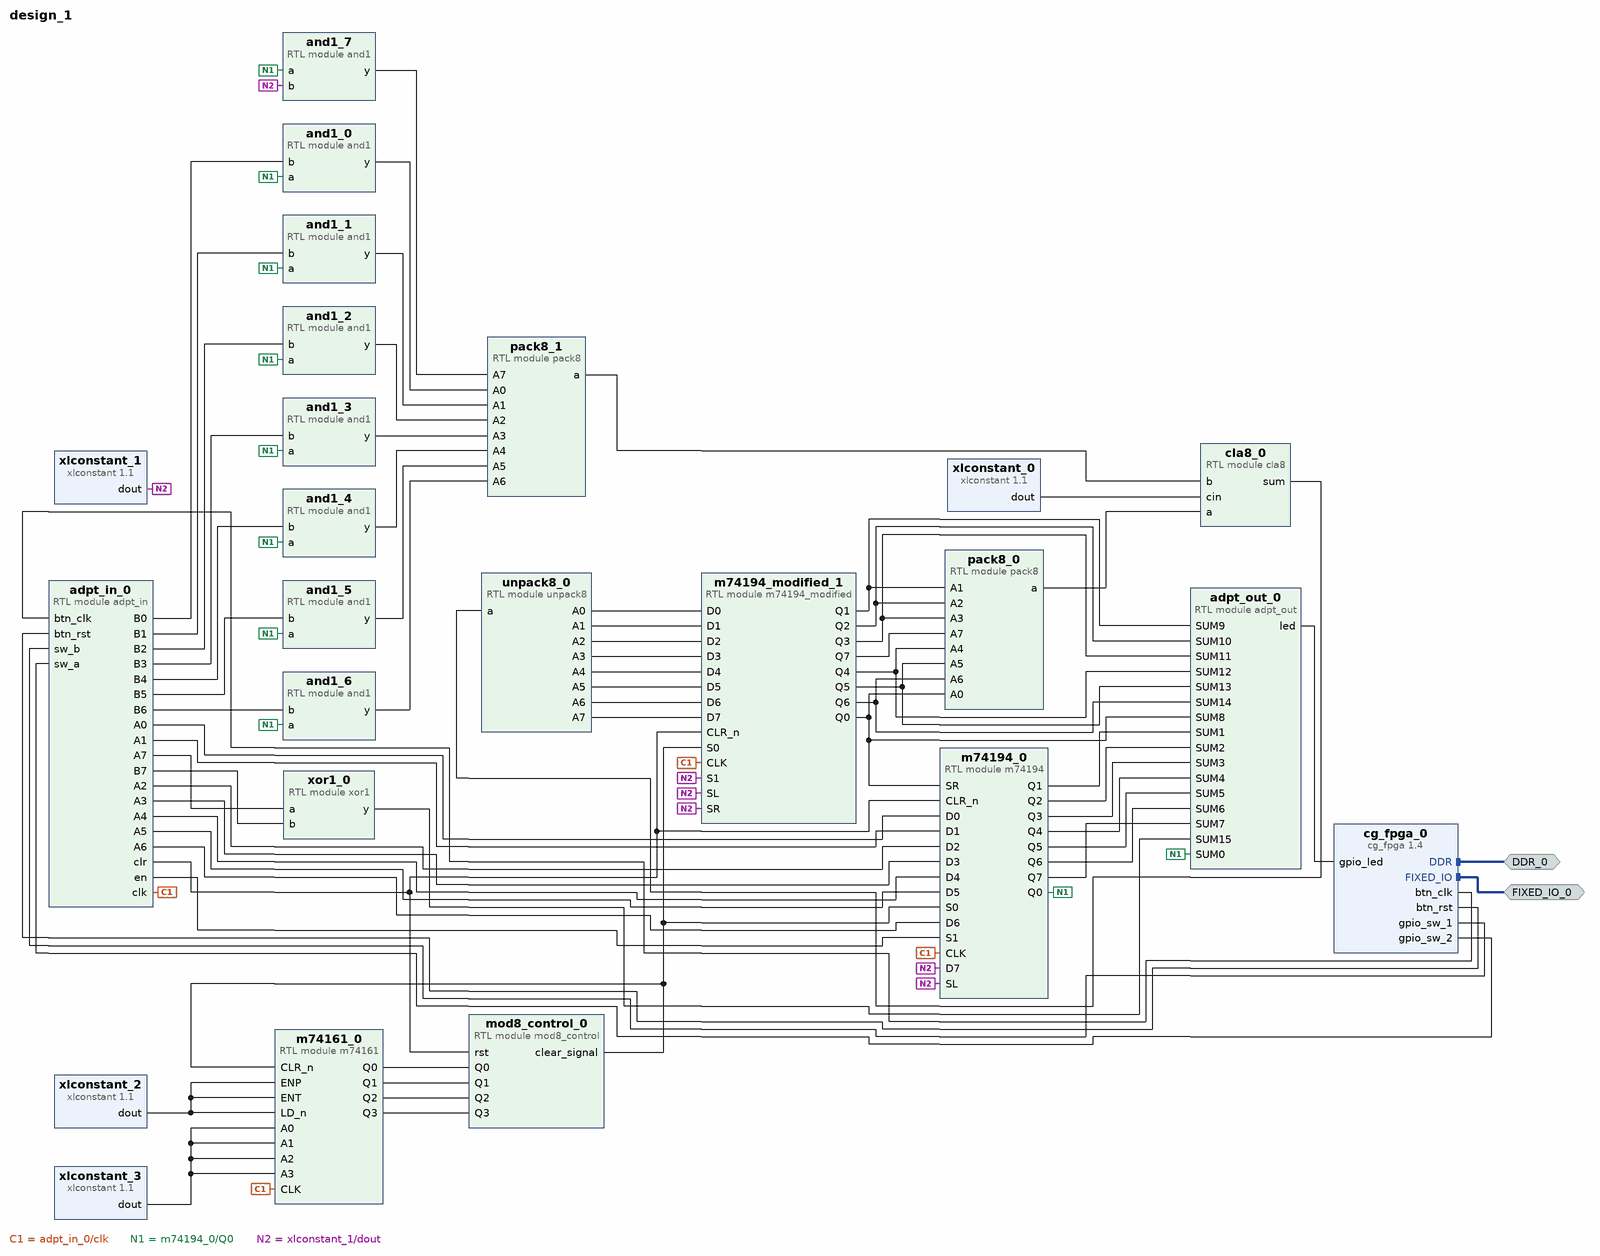
[diagram p0: block diagram of the top level]
# Vivado block design design_1, xc7z020clg400-1, Vivado 2024.2
create_bd_design design_1

create_bd_intf_port -mode Master -vlnv xilinx.com:display_processing_system7:fixedio_rtl:1.0 FIXED_IO_0
create_bd_intf_port -mode Master -vlnv xilinx.com:interface:ddrx_rtl:1.0 DDR_0

create_bd_cell -type ip -vlnv educg.net:user:cg_fpga:1.4 cg_fpga_0
create_bd_cell -type module -reference adpt_in adpt_in_0
create_bd_cell -type module -reference adpt_out adpt_out_0
create_bd_cell -type module -reference cla8 cla8_0
create_bd_cell -type ip -vlnv xilinx.com:ip:xlconstant:1.1 xlconstant_0
set_property -dict {CONFIG.CONST_VAL 0} [get_bd_cells xlconstant_0]
create_bd_cell -type module -reference pack8 pack8_0
create_bd_cell -type module -reference mod8_control mod8_control_0
create_bd_cell -type module -reference pack8 pack8_1
create_bd_cell -type module -reference unpack8 unpack8_0
create_bd_cell -type module -reference and1 and1_0
create_bd_cell -type module -reference and1 and1_1
create_bd_cell -type module -reference and1 and1_2
create_bd_cell -type module -reference and1 and1_3
create_bd_cell -type module -reference and1 and1_4
create_bd_cell -type module -reference and1 and1_5
create_bd_cell -type module -reference and1 and1_6
create_bd_cell -type module -reference and1 and1_7
create_bd_cell -type ip -vlnv xilinx.com:ip:xlconstant:1.1 xlconstant_1
set_property -dict {CONFIG.CONST_VAL 0} [get_bd_cells xlconstant_1]
create_bd_cell -type module -reference m74161 m74161_0
create_bd_cell -type ip -vlnv xilinx.com:ip:xlconstant:1.1 xlconstant_2
create_bd_cell -type ip -vlnv xilinx.com:ip:xlconstant:1.1 xlconstant_3
set_property -dict {CONFIG.CONST_VAL 0} [get_bd_cells xlconstant_3]
create_bd_cell -type module -reference m74194 m74194_0
create_bd_cell -type module -reference xor1 xor1_0
create_bd_cell -type module -reference m74194_modified m74194_modified_1

# ---- connections ----

connect_bd_intf_net [get_bd_intf_ports DDR_0] [get_bd_intf_pins cg_fpga_0/DDR]
connect_bd_intf_net [get_bd_intf_ports FIXED_IO_0] [get_bd_intf_pins cg_fpga_0/FIXED_IO]
connect_bd_net [get_bd_pins adpt_in_0/A0] [get_bd_pins m74194_0/D0]
connect_bd_net [get_bd_pins adpt_in_0/A1] [get_bd_pins m74194_0/D1]
connect_bd_net [get_bd_pins adpt_in_0/A2] [get_bd_pins m74194_0/D2]
connect_bd_net [get_bd_pins adpt_in_0/A3] [get_bd_pins m74194_0/D3]
connect_bd_net [get_bd_pins adpt_in_0/A4] [get_bd_pins m74194_0/D4]
connect_bd_net [get_bd_pins adpt_in_0/A5] [get_bd_pins m74194_0/D5]
connect_bd_net [get_bd_pins adpt_in_0/A6] [get_bd_pins m74194_0/D6]
connect_bd_net [get_bd_pins adpt_in_0/A7] [get_bd_pins xor1_0/a]
connect_bd_net [get_bd_pins adpt_in_0/B0] [get_bd_pins and1_0/b]
connect_bd_net [get_bd_pins adpt_in_0/B1] [get_bd_pins and1_1/b]
connect_bd_net [get_bd_pins adpt_in_0/B2] [get_bd_pins and1_2/b]
connect_bd_net [get_bd_pins adpt_in_0/B3] [get_bd_pins and1_3/b]
connect_bd_net [get_bd_pins adpt_in_0/B4] [get_bd_pins and1_4/b]
connect_bd_net [get_bd_pins adpt_in_0/B5] [get_bd_pins and1_5/b]
connect_bd_net [get_bd_pins adpt_in_0/B6] [get_bd_pins and1_6/b]
connect_bd_net [get_bd_pins adpt_in_0/B7] [get_bd_pins xor1_0/b]
connect_bd_net [get_bd_pins adpt_in_0/clk] [get_bd_pins m74161_0/CLK] [get_bd_pins m74194_0/CLK] [get_bd_pins m74194_modified_1/CLK]
connect_bd_net [get_bd_pins adpt_in_0/clr] [get_bd_pins m74194_0/CLR_n] [get_bd_pins m74194_modified_1/CLR_n] [get_bd_pins mod8_control_0/rst]
connect_bd_net [get_bd_pins adpt_in_0/en] [get_bd_pins m74194_0/S1]
connect_bd_net [get_bd_pins adpt_out_0/led] [get_bd_pins cg_fpga_0/gpio_led]
connect_bd_net [get_bd_pins and1_0/y] [get_bd_pins pack8_1/A0]
connect_bd_net [get_bd_pins and1_1/y] [get_bd_pins pack8_1/A1]
connect_bd_net [get_bd_pins and1_2/y] [get_bd_pins pack8_1/A2]
connect_bd_net [get_bd_pins and1_3/y] [get_bd_pins pack8_1/A3]
connect_bd_net [get_bd_pins and1_4/y] [get_bd_pins pack8_1/A4]
connect_bd_net [get_bd_pins and1_5/y] [get_bd_pins pack8_1/A5]
connect_bd_net [get_bd_pins and1_6/y] [get_bd_pins pack8_1/A6]
connect_bd_net [get_bd_pins and1_7/y] [get_bd_pins pack8_1/A7]
connect_bd_net [get_bd_pins cg_fpga_0/btn_clk] [get_bd_pins adpt_in_0/btn_clk]
connect_bd_net [get_bd_pins cg_fpga_0/btn_rst] [get_bd_pins adpt_in_0/btn_rst]
connect_bd_net [get_bd_pins cg_fpga_0/gpio_sw_1] [get_bd_pins adpt_in_0/sw_b]
connect_bd_net [get_bd_pins cg_fpga_0/gpio_sw_2] [get_bd_pins adpt_in_0/sw_a]
connect_bd_net [get_bd_pins cla8_0/sum] [get_bd_pins unpack8_0/a]
connect_bd_net [get_bd_pins m74161_0/Q0] [get_bd_pins mod8_control_0/Q0]
connect_bd_net [get_bd_pins m74161_0/Q1] [get_bd_pins mod8_control_0/Q1]
connect_bd_net [get_bd_pins m74161_0/Q2] [get_bd_pins mod8_control_0/Q2]
connect_bd_net [get_bd_pins m74161_0/Q3] [get_bd_pins mod8_control_0/Q3]
connect_bd_net [get_bd_pins m74194_0/Q0] \
  [get_bd_pins and1_0/a] [get_bd_pins and1_1/a] [get_bd_pins and1_2/a] [get_bd_pins and1_3/a] [get_bd_pins and1_4/a] \
  [get_bd_pins and1_5/a] [get_bd_pins and1_6/a] [get_bd_pins and1_7/a] [get_bd_pins adpt_out_0/SUM0]
connect_bd_net [get_bd_pins m74194_0/Q1] [get_bd_pins adpt_out_0/SUM1]
connect_bd_net [get_bd_pins m74194_0/Q2] [get_bd_pins adpt_out_0/SUM2]
connect_bd_net [get_bd_pins m74194_0/Q3] [get_bd_pins adpt_out_0/SUM3]
connect_bd_net [get_bd_pins m74194_0/Q4] [get_bd_pins adpt_out_0/SUM4]
connect_bd_net [get_bd_pins m74194_0/Q5] [get_bd_pins adpt_out_0/SUM5]
connect_bd_net [get_bd_pins m74194_0/Q6] [get_bd_pins adpt_out_0/SUM6]
connect_bd_net [get_bd_pins m74194_0/Q7] [get_bd_pins adpt_out_0/SUM7]
connect_bd_net [get_bd_pins m74194_modified_1/Q0] [get_bd_pins m74194_0/SR] [get_bd_pins pack8_0/A0] [get_bd_pins adpt_out_0/SUM8]
connect_bd_net [get_bd_pins m74194_modified_1/Q1] [get_bd_pins pack8_0/A1] [get_bd_pins adpt_out_0/SUM9]
connect_bd_net [get_bd_pins m74194_modified_1/Q2] [get_bd_pins pack8_0/A2] [get_bd_pins adpt_out_0/SUM10]
connect_bd_net [get_bd_pins m74194_modified_1/Q3] [get_bd_pins pack8_0/A3] [get_bd_pins adpt_out_0/SUM11]
connect_bd_net [get_bd_pins m74194_modified_1/Q4] [get_bd_pins pack8_0/A4] [get_bd_pins adpt_out_0/SUM12]
connect_bd_net [get_bd_pins m74194_modified_1/Q5] [get_bd_pins pack8_0/A5] [get_bd_pins adpt_out_0/SUM13]
connect_bd_net [get_bd_pins m74194_modified_1/Q6] [get_bd_pins pack8_0/A6] [get_bd_pins adpt_out_0/SUM14]
connect_bd_net [get_bd_pins m74194_modified_1/Q7] [get_bd_pins pack8_0/A7]
connect_bd_net [get_bd_pins mod8_control_0/clear_signal] [get_bd_pins m74161_0/CLR_n] [get_bd_pins m74194_0/S0] [get_bd_pins m74194_modified_1/S0]
connect_bd_net [get_bd_pins pack8_0/a] [get_bd_pins cla8_0/a]
connect_bd_net [get_bd_pins pack8_1/a] [get_bd_pins cla8_0/b]
connect_bd_net [get_bd_pins unpack8_0/A0] [get_bd_pins m74194_modified_1/D0]
connect_bd_net [get_bd_pins unpack8_0/A1] [get_bd_pins m74194_modified_1/D1]
connect_bd_net [get_bd_pins unpack8_0/A2] [get_bd_pins m74194_modified_1/D2]
connect_bd_net [get_bd_pins unpack8_0/A3] [get_bd_pins m74194_modified_1/D3]
connect_bd_net [get_bd_pins unpack8_0/A4] [get_bd_pins m74194_modified_1/D4]
connect_bd_net [get_bd_pins unpack8_0/A5] [get_bd_pins m74194_modified_1/D5]
connect_bd_net [get_bd_pins unpack8_0/A6] [get_bd_pins m74194_modified_1/D6]
connect_bd_net [get_bd_pins unpack8_0/A7] [get_bd_pins m74194_modified_1/D7]
connect_bd_net [get_bd_pins xlconstant_0/dout] [get_bd_pins cla8_0/cin]
connect_bd_net [get_bd_pins xlconstant_1/dout] \
  [get_bd_pins and1_7/b] [get_bd_pins m74194_0/D7] [get_bd_pins m74194_0/SL] [get_bd_pins m74194_modified_1/SR] \
  [get_bd_pins m74194_modified_1/SL] [get_bd_pins m74194_modified_1/S1]
connect_bd_net [get_bd_pins xlconstant_2/dout] [get_bd_pins m74161_0/ENP] [get_bd_pins m74161_0/ENT] [get_bd_pins m74161_0/LD_n]
connect_bd_net [get_bd_pins xlconstant_3/dout] [get_bd_pins m74161_0/A3] [get_bd_pins m74161_0/A2] [get_bd_pins m74161_0/A1] [get_bd_pins m74161_0/A0]
connect_bd_net [get_bd_pins xor1_0/y] [get_bd_pins adpt_out_0/SUM15]

validate_bd_design
save_bd_design
